# EAGLE schematic top (EAGLE 9.6.1)
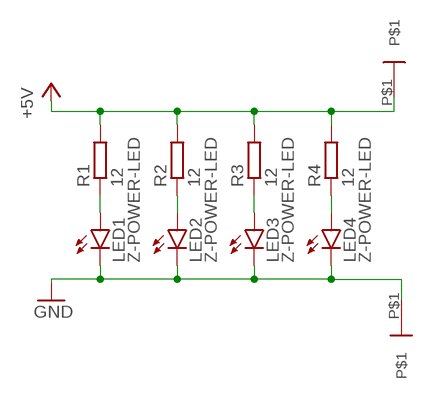
[diagram p0: schematic, sheet 1]

## Parts
LED1  Z-POWER-LED  [Z-POWER-LED-PCB-TYPE]
LED2  Z-POWER-LED  [Z-POWER-LED-PCB-TYPE]
LED3  Z-POWER-LED  [Z-POWER-LED-PCB-TYPE]
LED4  Z-POWER-LED  [Z-POWER-LED-PCB-TYPE]
R1  12  R-EU_R0805  [R0805]
R2  12  R-EU_R0805  [R0805]
R3  12  R-EU_R0805  [R0805]
R4  12  R-EU_R0805  [R0805]
U$1  PAD  [PAD]
U$2  PAD  [PAD]

## Nets
+5V: R1.2 R2.2 R3.2 R4.2 U$2.P$1
GND: LED1.C LED2.C LED3.C LED4.C U$1.P$1
N$1: LED4.A R4.1
N$3: LED3.A R3.1
N$4: LED2.A R2.1
N$5: LED1.A R1.1

## Library data of the parts
LED1-LED4 = led:Z-POWER-LED: Z-Power LED Source: http://www.seoulsemicon.co.kr .. X42182.pdf
R1-R4 = rcl-2:R-EU_: RESISTOR, European symbol
U$1 U$2 = connector:PAD